# EAGLE design ESP-12E Dev Board_with_level_shifter (EAGLE 9.4.0)

## Sheet 1 of 2
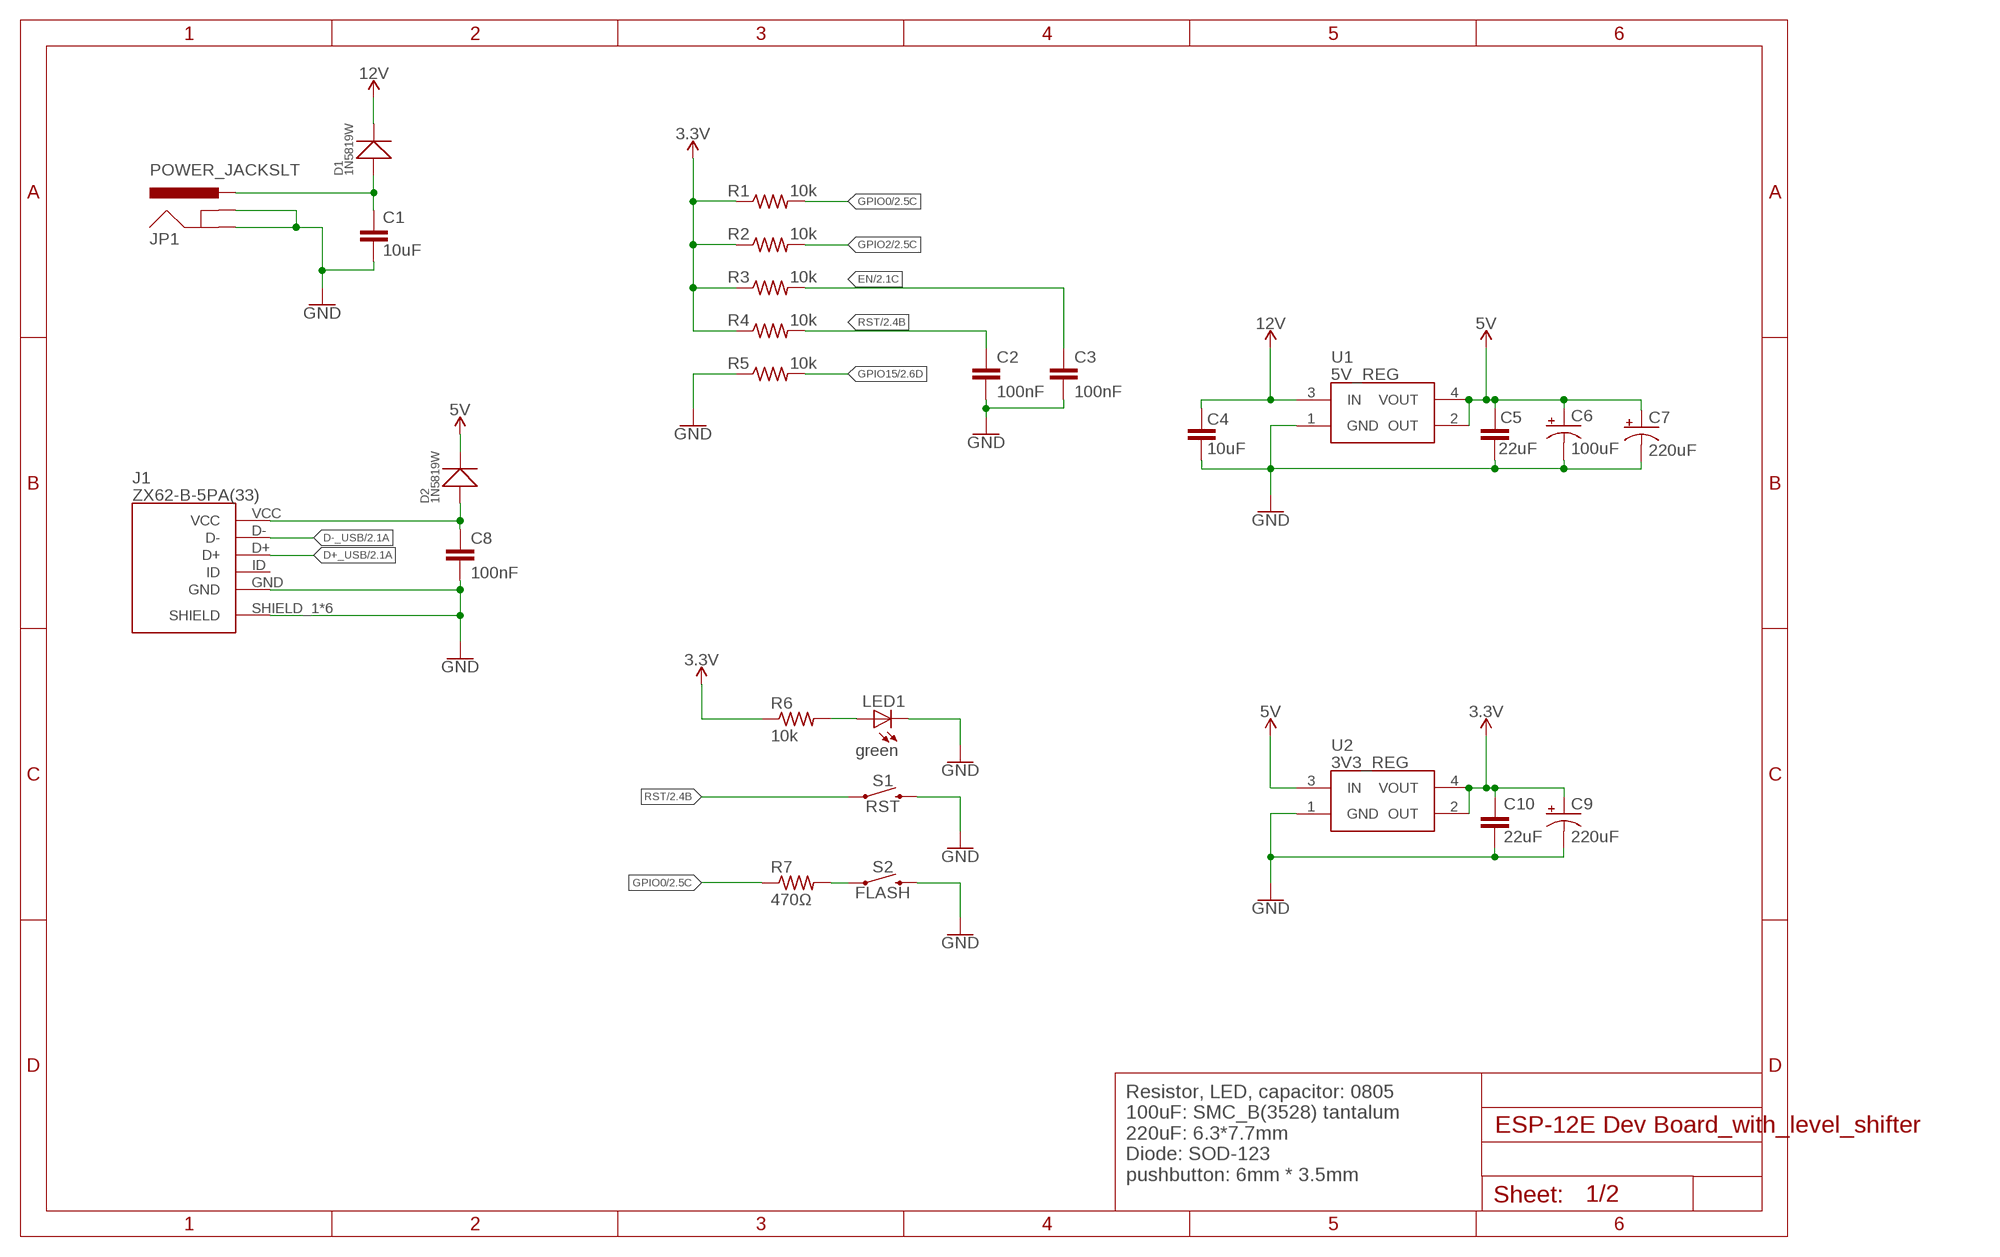
[diagram p0: schematic, sheet 1]

### Parts
C1  10uF  C-EUC0805  [C0805]
C2  100nF  C-EUC0805  [C0805]
C3  100nF  C-EUC0805  [C0805]
C4  10uF  C-EUC0805  [C0805]
C5  22uF  C-EUC0805  [C0805]
C6  100uF  CPOL-USSMCB  [SMC_B]
C7  220uF  CPOL-USUD-6,3X7,7  [UD-6,3X7,7_NICHICON]
C8  100nF  C-EUC0805  [C0805]
C9  220uF  CPOL-USUD-6,3X7,7  [UD-6,3X7,7_NICHICON]
C10  22uF  C-EUC0805  [C0805]
D1  1N5819W  SMD-DIODE-SCHOTTKY-20V-500MA(SOD-123)  [SOD-123]
D2  1N5819W  SMD-DIODE-SCHOTTKY-20V-500MA(SOD-123)  [SOD-123]
J1  ZX62-B-5PA(33)  [ZX62B5PA33]
JP1  POWER_JACKSLT  [POWER_JACK_SLOT]
LED1  green  LEDCHIP-LED0805  [CHIP-LED0805]
R1  10k  R-US_R0805  [R0805]
R2  10k  R-US_R0805  [R0805]
R3  10k  R-US_R0805  [R0805]
R4  10k  R-US_R0805  [R0805]
R5  10k  R-US_R0805  [R0805]
R6  10k  R-US_R0805  [R0805]
R7  470Ω  R-US_R0805  [R0805]
S1  RST  MOMENTARY-SWITCH-SPST-SMD-6.0X3.5MM  [TACTILE_SWITCH_SMD_6.0X3.5MM]
S2  FLASH  MOMENTARY-SWITCH-SPST-SMD-6.0X3.5MM  [TACTILE_SWITCH_SMD_6.0X3.5MM]
U1  5V_REG  AZ1117H-5.0TRE1  [SOT230P700X170-4N]
U2  3V3_REG  AZ1117H-5.0TRE1  [SOT230P700X170-4N]

### Nets
3.3V [power]: C9.+ C10.2 R1.1 R2.1 R3.1 R4.1 R6.1 U2.2(OUT) U2.4(VOUT) ; also sheet 2
5V [power]: C5.1 C6.+ C7.+ D2.- U1.2(OUT) U1.4(VOUT) U2.3(IN) ; also sheet 2
12V [power]: C4.1 D1.- U1.3(IN) ; also sheet 2
D+_USB: J1.D+ ; also sheet 2
D-_USB: J1.D- ; also sheet 2
EN: C3.2 R3.2 ; also sheet 2
GND [power]: C1.1 C2.1 C3.1 C4.2 C5.2 C6.- C7.- C8.1 C9.- C10.1 J1.GND J1.SHIELD_1(SHIELD) J1.SHIELD_2(SHIELD) J1.SHIELD_3(SHIELD) J1.SHIELD_4(SHIELD) J1.SHIELD_5(SHIELD) J1.SHIELD_6(SHIELD) JP1.GND@1(GNDBREAK) JP1.GND@2(GND) LED1.C R5.1 S1.2 S2.2 U1.1(GND) U2.1(GND) ; also sheet 2
GPIO0: R1.2 R7.1 ; also sheet 2
GPIO2: R2.2 ; also sheet 2
GPIO15: R5.2 ; also sheet 2
N$3: C1.2 D1.+ JP1.PWR
N$4: LED1.A R6.2
N$10 [power]: C8.2 D2.+ J1.VCC
POWER1: R7.2 S2.1
RST: C2.2 R4.2 S1.1 ; also sheet 2
Unconnected: J1.ID

### Notes on the sheet
- Resistor, LED, capacitor: 0805
  100uF: SMC_B(3528) tantalum
  220uF: 6.3*7.7mm
  Diode: SOD-123
  pushbutton: 6mm * 3.5mm

## Sheet 2 of 2
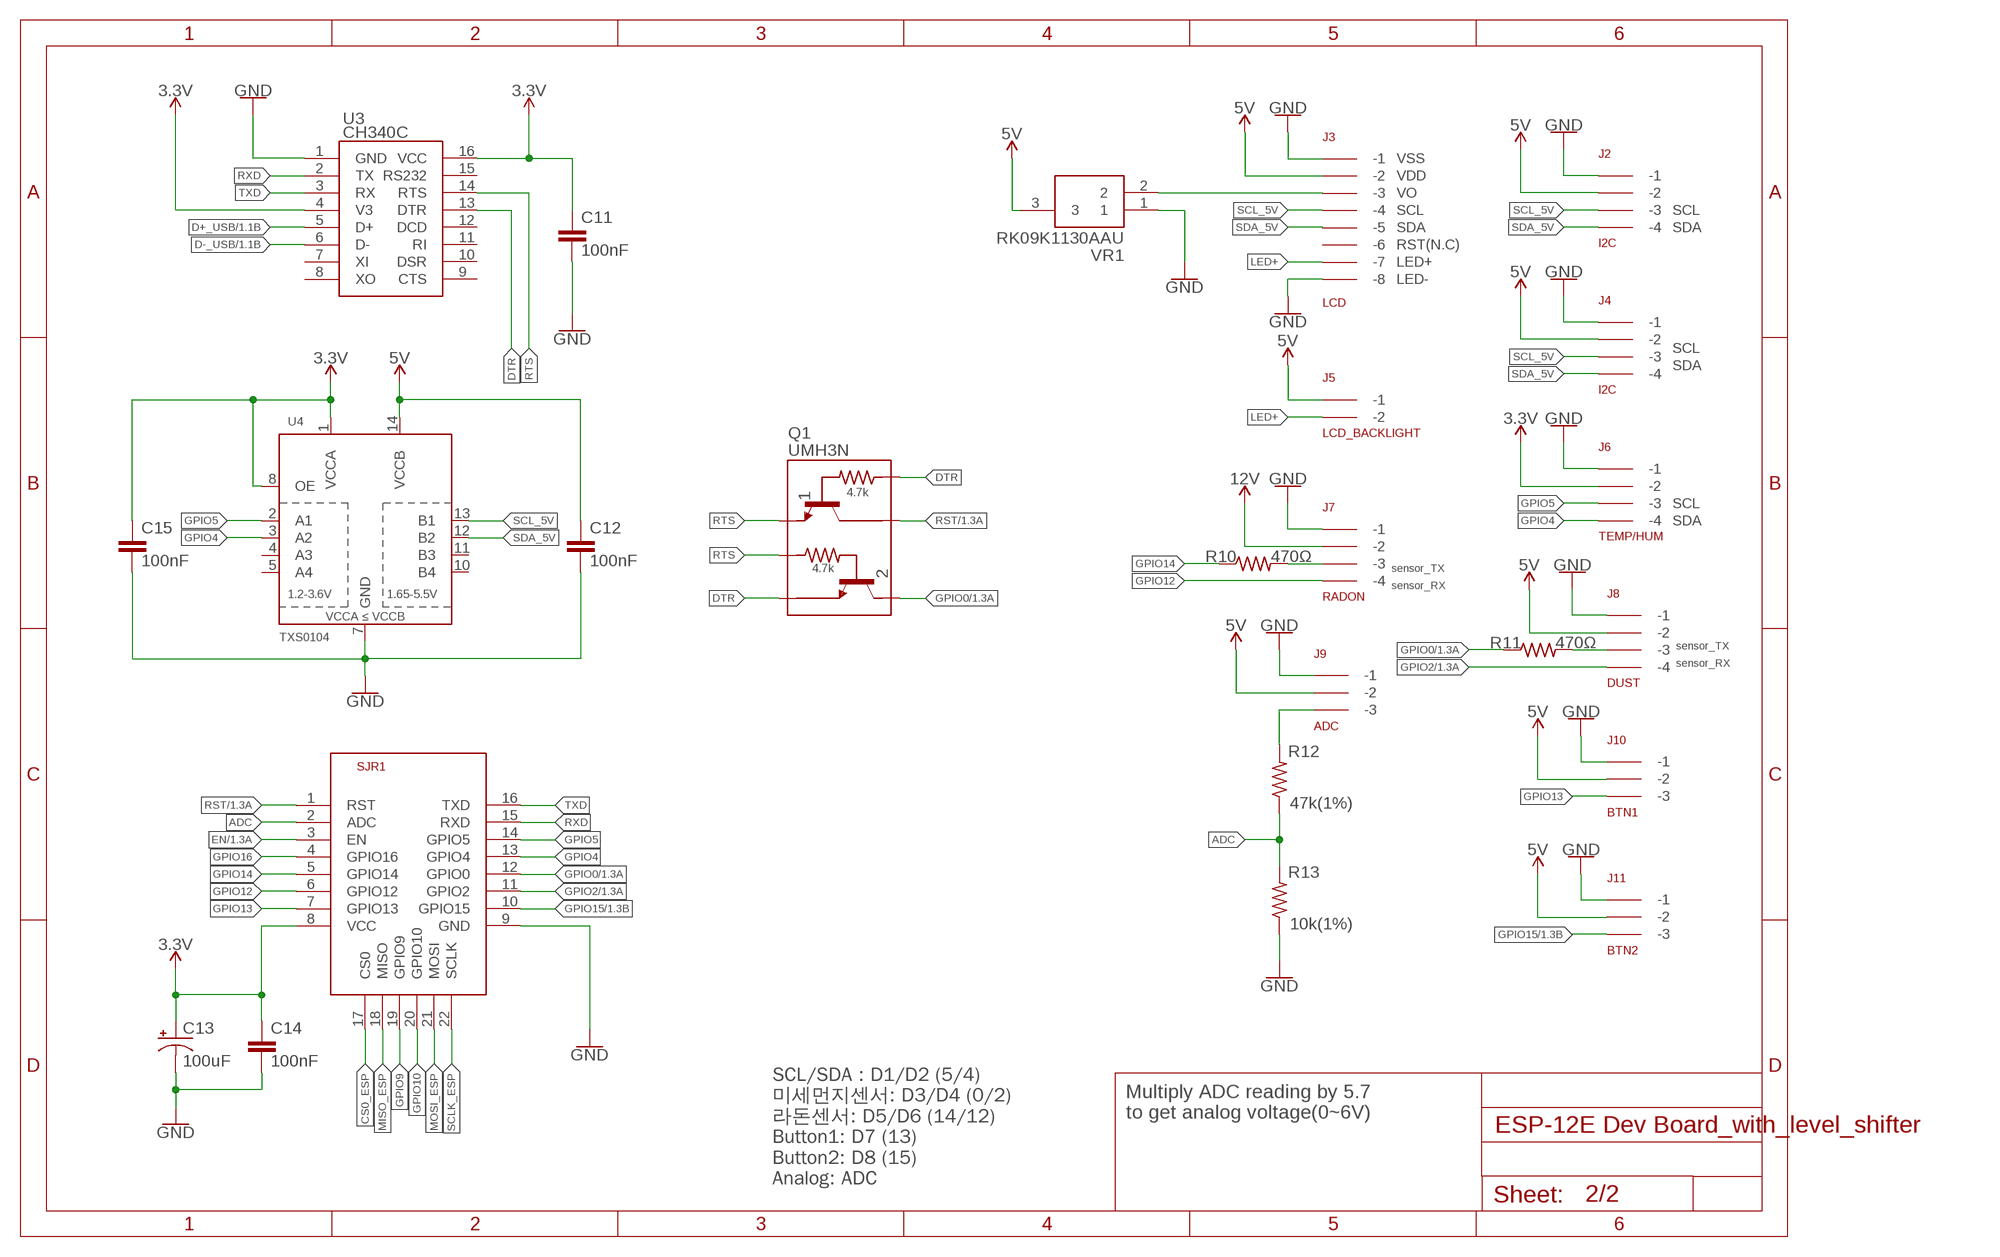
[diagram p1: schematic, sheet 2]

### Parts
C11  100nF  C-EUC0805  [C0805]
C12  100nF  C-EUC0805  [C0805]
C13  100uF  CPOL-USSMCB  [SMC_B]
C14  100nF  C-EUC0805  [C0805]
C15  100nF  C-EUC0805  [C0805]
J2  I2C  5267-4  [5267-4]
J3  LCD  5267-8  [5267-8]
J4  I2C  5267-4  [5267-4]
J5  LCD_BACKLIGHT  5267-2  [5267-2]
J6  TEMP/HUM  5267-4  [5267-4]
J7  RADON  5267-4  [5267-4]
J8  DUST  5267-4  [5267-4]
J9  ADC  5267-3  [5267-3]
J10  BTN1  5267-3  [5267-3]
J11  BTN2  5267-3  [5267-3]
Q1  UMH3N  UMH3NFHATN  [SOT65P210X100-6N]
R10  470Ω  R-US_R0805  [R0805]
R11  470Ω  R-US_R0805  [R0805]
R12  47k(1%)  R-US_R0805  [R0805]
R13  10k(1%)  R-US_R0805  [R0805]
SJR1  ESP-12E  ESP8266-12EESP12E  [ESP8266-ESP12E]
U3  CH340C  CH340G  [SOIC16]
U4  TXS0104  TXB0104PWR  [TSSOP14]
VR1  RK09K1130AAU  RK09K1130A6S  [RK09K1130BGM]

### Nets
3.3V [power]: C11.2 C13.+ C14.2 C15.2 J6.P$2(-2) SJR1.8(VCC) U3.4(V3) U3.16(VCC) U4.1(VCCA) U4.8(OE) ; also sheet 1
5V [power]: C12.2 J2.P$2(-2) J3.P$2(-2) J4.P$2(-2) J5.P$1(-1) J8.P$2(-2) J9.P$2(-2) J10.P$2(-2) J11.P$2(-2) U4.14(VCCB) VR1.3 ; also sheet 1
12V [power]: J7.P$2(-2) ; also sheet 1
ADC: R12.1 R13.2 SJR1.2(ADC)
CS0_ESP: SJR1.17(CS0)
D+_USB: U3.5(D+) ; also sheet 1
D-_USB: U3.6(D-) ; also sheet 1
DTR: Q1.2 Q1.4 U3.13(DTR)
EN: SJR1.3(EN) ; also sheet 1
GND [power]: C11.1 C12.1 C13.- C14.1 C15.1 J2.P$1(-1) J3.P$1(-1) J3.P$8(-8) J4.P$1(-1) J6.P$1(-1) J7.P$1(-1) J8.P$1(-1) J9.P$1(-1) J10.P$1(-1) J11.P$1(-1) R13.1 SJR1.9(GND) U3.1(GND) U4.7(GND) VR1.1 ; also sheet 1
GPIO0: Q1.3 R11.1 SJR1.12(GPIO0) ; also sheet 1
GPIO2: J8.P$4(-4) SJR1.11(GPIO2) ; also sheet 1
GPIO4: J6.P$4(-4) SJR1.13(GPIO4) U4.3(A2)
GPIO5: J6.P$3(-3) SJR1.14(GPIO5) U4.2(A1)
GPIO9: SJR1.19(GPIO9)
GPIO10: SJR1.20(GPIO10)
GPIO12: J7.P$4(-4) SJR1.6(GPIO12)
GPIO13: J10.P$3(-3) SJR1.7(GPIO13)
GPIO14: R10.1 SJR1.5(GPIO14)
GPIO15: J11.P$3(-3) SJR1.10(GPIO15) ; also sheet 1
GPIO16: SJR1.4(GPIO16)
LED+: J3.P$7(-7) J5.P$2(-2)
MISO_ESP: SJR1.18(MISO)
MOSI_ESP: SJR1.21(MOSI)
N$2: J3.P$3(-3) VR1.2
N$5: J9.P$3(-3) R12.2
N$6: J7.P$3(-3) R10.2
N$9: J8.P$3(-3) R11.2
RST: Q1.6 SJR1.1(RST) ; also sheet 1
RTS: Q1.1 Q1.5 U3.14(RTS)
RXD: SJR1.15(RXD) U3.2(TX)
SCL_5V: J2.P$3(-3) J3.P$4(-4) J4.P$3(-3) U4.13(B1)
SCLK_ESP: SJR1.22(SCLK)
SDA_5V: J2.P$4(-4) J3.P$5(-5) J4.P$4(-4) U4.12(B2)
TXD: SJR1.16(TXD) U3.3(RX)
Unconnected: J3.P$6(-6) U3.7(XI) U3.8(XO) U3.9(CTS) U3.10(DSR) U3.11(RI) U3.12(DCD) U3.15(RS232) U4.4(A3) U4.5(A4) U4.10(B4) U4.11(B3)

### Notes on the sheet
- VSS
- VDD
- VO
- SCL | SCL
- SDA | SDA
- RST(N.C)
- LED+
- LED-
- SCL
- SDA
- SCL
- SDA
- sensor_TX
- sensor_RX
- sensor_TX
- sensor_RX
- SCL/SDA : D1/D2 (5/4)
  미세먼지센서: D3/D4 (0/2)
  라돈센서: D5/D6 (14/12)
  Button1: D7 (13)
  Button2: D8 (15)
  Analog: ADC
- Multiply ADC reading by 5.7
  to get analog voltage(0~6V)

## Library data of the parts
C1-C5 C8 C10-C12 C14 C15 = rcl:C-EU: CAPACITOR, European symbol; SPICEPREFIX: C
C6 C7 C9 C13 = rcl:CPOL-US: POLARIZED CAPACITOR, American symbol; SPICEPREFIX: C
D1 D2 = Seeed-Diode:SMD-DIODE-SCHOTTKY-20V-500MA(SOD-123): 304020032; MPN: SS0520-7-F; VALUE: 20V-500MA
J1 = SamacSys_Parts:ZX62-B-5PA(33): USB Connectors MICRO B RECEPT RA SMT BTTM MNT Source: Datasheet <https://componentsearchengine.com/Datasheets/1/ZX62-B-5PA(33).pdf>; DESCRIPTION: USB Connectors MICRO B RECEPT RA SMT BTTM MNT; HEIGHT: 2.8mm; MANUFACTURER_NAME: Hirose; MANUFACTURER_PART_NUMBER: ZX62-B-5PA(33); MOUSER_PART_NUMBER: 798-ZX62-B-5PA33; MOUSER_PRICE-STOCK: https://www.mouser.com/Search/Refine.aspx?Keyword=798-ZX62-B-5PA33
J2 J4 J6-J8 = con-molex-spox:5267-4
J3 = con-molex-spox:5267-8
J5 = con-molex-spox:5267-2
J9-J11 = con-molex-spox:5267-3
JP1 = kanflo:POWER_JACK: Power Jack This is the standard 5.5mm barrel jack for power. The SLT footprint has been proven in designs produced by DirtyPCBs.com and only works if the mill layer is transmitted to the PCB fab house and the fab house accepts it. Rumours has it OSH Park accepts this design too. This symbol is meant for the cheap PCB mount connectors you find on eBay, retailing at less than 2EUR/10pcs (search for "dc power jack 5.5 2.1 pcb"). The difference between these and the ones sold by eg. SparkFun is the location of the pads relative to the plastic body.
LED1 = adafruit:LED: LED OSRAM: - CHIPLED LG R971, LG N971, LY N971, LG Q971, LY Q971, LO R971, LY R971 LH N974, LH R974 LS Q976, LO Q976, LY Q976 LO Q996 - Hyper CHIPLED LW Q18S LB Q993, LB Q99A, LB R99A - SideLED LS A670, LO A670, LY A670, LG A670, LP A670 LB A673, LV A673, LT A673, LW A673 LH A674 LY A675 LS A676, LA A676, LO A676, LY A676, LW A676 LS A679, LY A679, LG A679 - Hyper Micro SIDELED® LS Y876, LA Y876, LO Y876, LY Y876 LT Y87S - SmartLED LW L88C, LW L88S LB L89C, LB L89S, LG L890 LS L89K, LO L89K, LY L89K LS L896, LA L896, LO L896, LY L896 - TOPLED LS T670, LO T670, LY T670, LG T670, LP T670 LSG T670, LSP T670, LSY T670, LOP T670, LYG T670 LG T671, LOG T671, LSG T671 LB T673, LV T673, LT T673, LW T673 LH T674 LS T676, LA T676, LO T676, LY T676, LB T676, LH T676, LSB T676, LW T676 LB T67C, LV T67C, LT T67C, LS T67K, LO T67K, LY T67K, LW E67C LS E67B, LA E67B, LO E67B, LY E67B, LB E67C, LV E67C, LT E67C LW T67C LS T679, LY T679, LG T679 LS T770, LO T770, LY T770, LG T770, LP T770 LB T773, LV T773, LT T773, LW T773 LH T774 LS E675, LA E675, LY E675, LS T675 LS T776, LA T776, LO T776, LY T776, LB T776 LHGB T686 LT T68C, LB T68C - Hyper Mini TOPLED® LB M676 - Mini TOPLED Santana® LG M470 LS M47K, LO M47K, LY M47K Source: http://www.osram.convergy.de/
Q1 = SamacSys_Parts:UMH3NFHATN: ROHM - UMH3NFHATN - TRANS, NPN, AUTO, 4.7K/4.7K, SOT-353 Source: Datasheet <http://www.rohm.com/web/global/datasheet/UMH3NFHA/umh3nfha-e>; DESCRIPTION: ROHM - UMH3NFHATN - TRANS, NPN, AUTO, 4.7K/4.7K, SOT-353; HEIGHT: 1mm; MANUFACTURER_NAME: ROHM Semiconductor; MANUFACTURER_PART_NUMBER: UMH3NFHATN; MOUSER_PART_NUMBER: 755-UMH3NFHATN; MOUSER_PRICE-STOCK: https://www.mouser.com/Search/Refine.aspx?Keyword=755-UMH3NFHATN
R1-R7 R10-R13 = rcl:R-US_: RESISTOR, American symbol; SPICEPREFIX: R
S1 S2 = SparkFun-Switches:MOMENTARY-SWITCH-SPST: Momentary Switch (Pushbutton) - SPST Normally-open (NO) SPST momentary switches (buttons, pushbuttons). Variants PTH-12MM - 12mm square, through-hole Momentary Pushbutton Switch - 12mm Square <https://www.sparkfun.com/products/9190> (COM-09190) PTH-6.0MM, PTH-6.0MM-KIT - 6.0mm square, through-hole Mini Pushbutton Switch <https://www.sparkfun.com/products/97> (COM-00097) KIT package intended for soldering kit's - only one side of pads' copper is exposed. PTH-RIGHT-ANGLE-KIT - Right-angle, through-hole Right Angle Tactile Button <https://www.sparkfun.com/products/10791> - Used on SparkFun BigTime Watch Kit <https://www.sparkfun.com/products/11734> SMD-12MM - 12mm square, surface-mount Tactile Button - SMD (12mm) <https://www.sparkfun.com/products/12993> (COM-12993) Used on SparkFun PicoBoard <https://www.sparkfun.com/products/11888> SMD-4.5MM - 4.5mm Square Trackball Switch Used on SparkFun Blackberry Trackballer Breakout <https://www.sparkfun.com/products/13169> SMD-4.6MMX2.8MM - 4.60mm x 2.80mm, surface mount Used on SparkFun SAMD21 Mini Breakout <https://www.sparkfun.com/products/13664> SMD-5.2MM, SMD-5.2-REDUNDANT - 5.2mm square, surface-mount Mini Pushbutton Switch - SMD <https://www.sparkfun.com/products/8720> (COM-08720) Used on Arduino Pro Mini <https://www.sparkfun.com/products/11114> REDUNDANT package connects both switch circuits together SMD-6.0X3.5MM - 6.0 x 3.5mm, surface mount Momentary Reset Switch SMD <https://www.sparkfun.com/products/8229> (COM-08229) SMD-6.2MM-TALL - 6.2mm square, surface mount Tactile Button - SMD (6mm) <https://www.sparkfun.com/products/12992> Used on SparkFun Digital Sandbox <https://www.sparkfun.com/products/12651> SMD-RIGHT-ANGLE - Right-angle, surface mount Used on SparkFun Block for Intel® Edison - Arduino <https://www.sparkfun.com/products/13036>; PROD_ID: SWCH-00815; SF_SKU: COM-08229
SJR1 = esp12e:ESP8266-12E: ESP8266-12E Library for Eagle CAD The author not responsible for any damages or errors!. Created by Suhail jr.lt;/author>
U1 U2 = SamacSys_Parts:AZ1117H-5.0TRE1: 1A 5V LDO Linear Voltage Reg SOT-223 Diodes Inc AZ1117H-5.0TRE1, Single Linear Voltage Regulator, 1A 4.9 5.1 V, 1%, 3-Pin SOT-223 Source: Datasheet <https://componentsearchengine.com/Datasheets/1/AZ1117H-5.0TRE1.pdf>; DESCRIPTION: 1A 5V LDO Linear Voltage Reg SOT-223 Diodes Inc AZ1117H-5.0TRE1, Single Linear Voltage Regulator, 1A 4.9 5.1 V, 1%, 3-Pin SOT-223; HEIGHT: 1.7mm; MANUFACTURER_NAME: Diodes Inc.; MANUFACTURER_PART_NUMBER: AZ1117H-5.0TRE1; MOUSER_PART_NUMBER: 621-AZ1117H-5.0TRE1; MOUSER_PRICE-STOCK: https://www.mouser.com/Search/Refine.aspx?Keyword=621-AZ1117H-5.0TRE1
U3 = ch340g:CH340G
U4 = SparkFun-IC-Comms:TXB0104PWR: 4-Bit Bi-Directional Level Shifter 1.2V-3.6V (VCCA) to 1.65V-5.5V (VCCB) bi-directional level shifter with auto direction sensing. Max data rate - VCCA 1.8V: 20Mbps (50ns), VCCA 3.3V: 100Mbps (10ns) Digikey: 296-21929-1-ND (TSSOP) Datasheet <http://cdn.sparkfun.com/datasheets/BreakoutBoards/txb0104.pdf> SparkFun Products SparkFun Cellular Shield - MG2639 <https://www.sparkfun.com/products/13120> (CEL-13120) SparkFun Level Shifting microSD Breakout <https://www.sparkfun.com/products/13743> (DEV-13743) SparkFun Voltage-Level Translator Breakout - TXB0104 <https://www.sparkfun.com/products/11771> (BOB-11771) SparkFun Block for Intel® Edison - UART <https://www.sparkfun.com/products/13040> (DEV-13040) SparkFun Block for Intel® Edison - Arduino <https://www.sparkfun.com/products/13036> (DEV-13036); PROD_ID: NA-XXXXX; VALUE: TXB0104
VR1 = SamacSys_Parts:RK09K1130A6S: Audio single pot. 10K Vertical 15mm,1B Alps RK09K Series, Linear Potentiometer with a 6 mm Dia. Shaft, 10k, +/-20%, Through Hole Source: Datasheet <https://componentsearchengine.com/Datasheets/1/RK09K1130A6S.pdf>; DESCRIPTION: Audio single pot. 10K Vertical 15mm,1B Alps RK09K Series, Linear Potentiometer with a 6 mm Dia. Shaft, 10k, +/-20%, Through Hole; HEIGHT: mm; MANUFACTURER_NAME: ALPS; MANUFACTURER_PART_NUMBER: RK09K1130A6S; MOUSER_PART_NUMBER: 688-RK09K1130A6S; MOUSER_PRICE-STOCK: https://www.mouser.com/Search/Refine.aspx?Keyword=688-RK09K1130A6S

## Net classes
1 power: width 0.457 mm

## Board
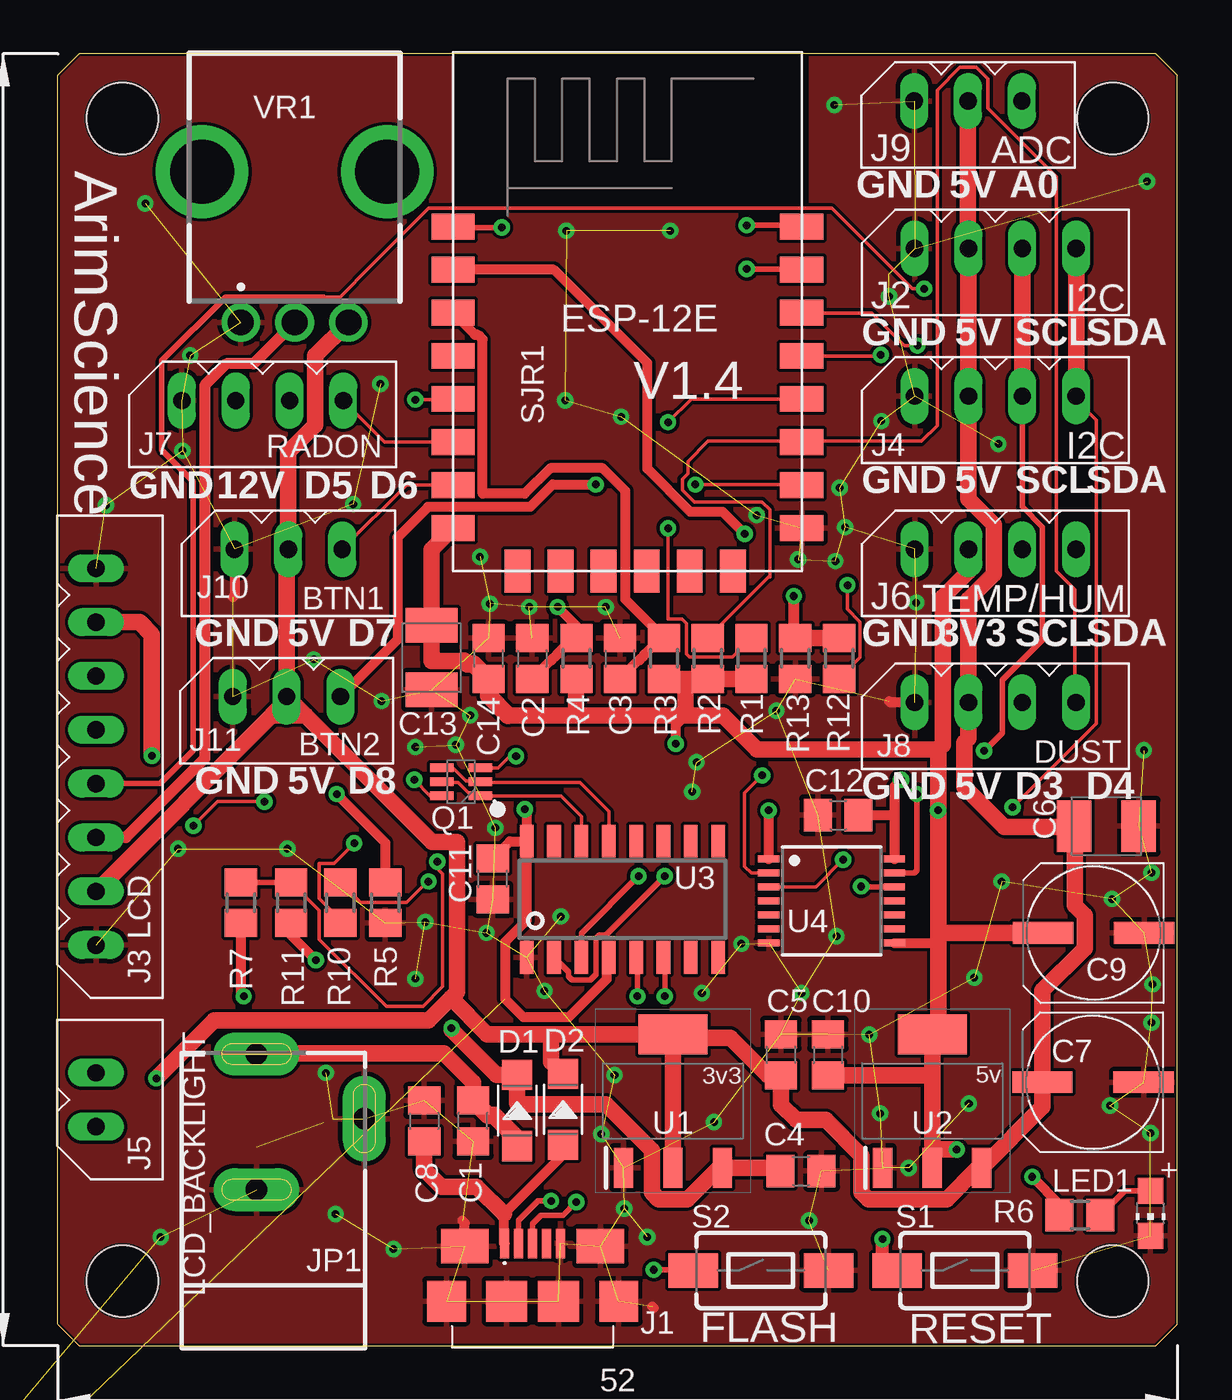
[diagram p2: board, top side]
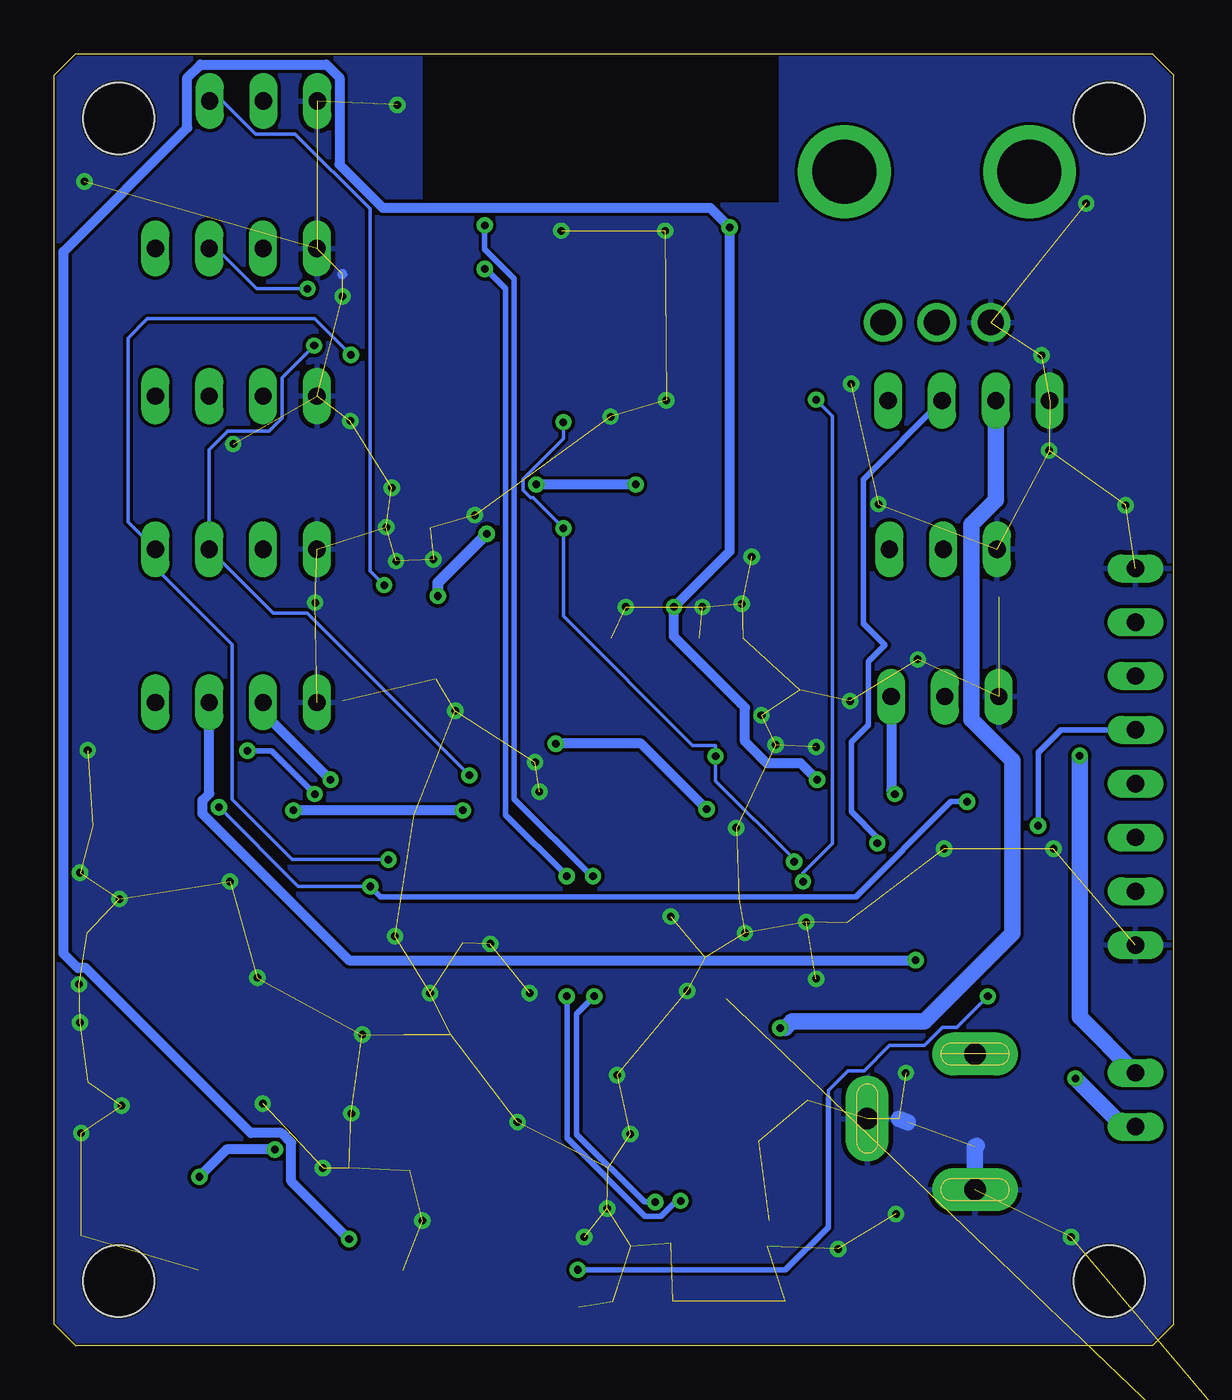
[diagram p3: board, bottom side, seen from below]

Size 52 x 60 mm. Coordinates in mm from the lower left corner, seen from the top.
Outline: 0,1 0,59 1,60 51,60 52,59 52,1 51,0 1,0 0,1
Copper layers (1*16): Top 0.035mm / dielectric 1.5mm / Bottom 0.035mm
Design rules "default *": minimum track width 6mil, minimum drill 0.35mm, track to track 6mil, track to pad 6mil, pad to pad 6mil, via to via 6mil, smd to smd 6mil, copper to edge 4mil, drill to drill 6mil, minimum pad ring 10mil, minimum via ring 8mil, stop-mask expansion 4mil, vias tented up to drill 15mil, thermal gap 8mil
Holes 3.3 mm at 3,57 49,57 49,3 3,3

### Footprints (pad centres in the part's own frame; a part is rotated, then mirrored left to right if it is on the bottom)
C0805 = smd 1.3 x 1.5: 1 -0.95,0; 2 0.95,0
SMC_B = smd 1.6 x 2.4: + -1.5,0; - 1.5,0
UD-6,3X7,7_NICHICON = smd 2.8 x 1: + 2.35,0; - -2.35,0
SOD-123 = smd 1.397 x 1.397: + -1.651,0; - 1.651,0
ZX62B5PA33 = smd 0.4 x 1.35: D+ 0,1.95; D- -0.65,1.95; GND 1.3,1.95; ID 0.65,1.95; VCC -1.3,1.95 | smd 2.2 x 1.6: SHIELD_1 -3.15,1.825; SHIELD_6 3.15,1.825 | smd 1.8 x 1.9: SHIELD_2 -4,-0.725; SHIELD_5 4,-0.725 | smd 1.9 x 1.9: SHIELD_3 -1.2,-0.725; SHIELD_4 1.2,-0.725
5267-4 = drill 0.8 long: P$1 0,0; P$2 2.5,0; P$3 5,0; P$4 7.5,0
5267-8 = drill 0.8 long: P$1 0,0; P$2 2.5,0; P$3 5,0; P$4 7.5,0; P$5 10,0; P$6 12.5,0; P$7 15,0; P$8 17.5,0
5267-2 = drill 0.8 long: P$1 0,0; P$2 2.5,0
5267-3 = drill 0.8 long: P$1 0,0; P$2 2.5,0; P$3 5,0
POWER_JACK_SLOT = drill 1 pad 2 long: GND@1 2.5,1.39; GND@2 -2.5,-1.91; PWR 2.5,-4.91
CHIP-LED0805 = smd 1.2 x 1.2: A 0,-1.05; C 0,1.05
SOT65P210X100-6N = smd 1.1 x 0.4: 1 -0.9,0.65; 2 -0.9,0; 3 -0.9,-0.65; 4 0.9,-0.65; 5 0.9,0; 6 0.9,0.65
R0805 = smd 1.3 x 1.5: 1 -0.95,0; 2 0.95,0
TACTILE_SWITCH_SMD_6.0X3.5MM = smd 2.3 x 1.6: 1 -3.15,0; 2 3.15,0
ESP8266-ESP12E = smd 2 x 1.2: 1 -7.62,5.84; 2 -7.62,3.84; 3 -7.62,1.84; 4 -7.62,-0.16; 5 -7.62,-2.16; 6 -7.62,-4.16; 7 -7.62,-6.16; 8 -7.62,-8.16; 9 8.58,-8.16; 10 8.58,-6.16; 11 8.58,-4.16; 12 8.58,-2.16; 13 8.58,-0.16; 14 8.58,1.84; 15 8.58,3.84; 16 8.58,5.84 | smd 1.2 x 2: 17 -4.62,-10.16; 18 -2.62,-10.16; 19 -0.62,-10.16; 20 1.38,-10.16; 21 3.38,-10.16; 22 5.38,-10.16
SOT230P700X170-4N = smd 1.85 x 0.9: 1 -3.1,2.3; 2 -3.1,0; 3 -3.1,-2.3 | smd 1.85 x 3.2: 4 3.1,0
SOIC16 = smd 0.635 x 1.524: 1 -4.445,-2.695; 2 -3.175,-2.695; 3 -1.905,-2.695; 4 -0.635,-2.695; 5 0.635,-2.695; 6 1.905,-2.695; 7 3.175,-2.695; 8 4.445,-2.695; 9 4.445,2.695; 10 3.175,2.695; 11 1.905,2.695; 12 0.635,2.695; 13 -0.635,2.695; 14 -1.905,2.695; 15 -3.175,2.695; 16 -4.445,2.695
TSSOP14 = smd 0.305 x 0.991: 1 -1.95,-2.918; 2 -1.3,-2.918; 3 -0.65,-2.918; 4 0,-2.918; 5 0.65,-2.918; 6 1.3,-2.918; 7 1.95,-2.918; 8 1.95,2.918; 9 1.3,2.918; 10 0.65,2.918; 11 0,2.918; 12 -0.65,2.918; 13 -1.3,2.918; 14 -1.95,2.918
RK09K1130BGM = drill 1.2 pad 1.8: 1 -2.5,-12.5; 2 0,-12.5; 3 2.5,-12.5 | drill 2.97 pad 4.3: 4 4.3,-5.5; 5 -4.3,-5.5

### Placement (x,y rotation side)
C1  19.29,10.43 90 top
C2  22.03,31.92 270 top
C3  26.11,31.92 270 top
C4  34.52,8.11 0 top
C5  33.59,13.51 90 top
C6  48.71,24.13 0 top
C7  48.08,12.23 180 top
C8  17.02,10.43 270 top
C9  48.11,19.17 180 top
C10  35.77,13.51 270 top
C11  20.2,21.68 90 top
C12  36.24,24.64 0 top
C13  17.36,31.96 270 top
C14  20,31.91 270 top
C15  -5.03,-7.7 0 top  (outside the outline)
D1  21.34,10.92 90 top
D2  23.47,10.97 90 top
J1  22.05,2.79 0 top
J2  39.8,50.96 0 top
J3  1.78,18.6 90 top
J4  39.8,44.1 0 top
J5  1.78,10.17 90 top
J6  39.8,36.99 0 top
J7  5.76,43.9 0 top
J8  39.8,29.88 0 top
J9  39.78,57.81 0 top
J10  8.21,36.99 0 top
J11  8.13,30.15 0 top
JP1  11.73,8.64 180 top
LED1  50.75,6.15 180 top
Q1  18.73,26.19 180 top
R1  32.22,31.92 90 top
R2  30.19,31.92 90 top
R3  28.15,31.92 90 top
R4  24.09,31.92 90 top
R5  15.21,20.57 90 top
R6  47.48,6.06 0 top
R7  8.51,20.57 270 top
R10  13.13,20.57 270 top
R11  10.84,20.57 270 top
R12  36.29,31.92 270 top
R13  34.26,31.92 90 top
S1  42.13,3.49 0 top
S2  32.65,3.49 0 top
SJR1  25.97,46.13 0 top
U1  28.57,11.37 90 top
U2  40.61,11.37 90 top
U3  26.23,20.73 0 top
U4  35.94,20.66 270 top
VR1  11,60.02 0 top

### Tracks (layer width: path | path; a pad name or v marks a point on that pad's centre or on a via)
3.3V  (via drill 0.35)  (1 unrouted)
  Top 0.457: U4.1 v33.02,24.86 | U4.8 40.85,18.7 40.89,18.66 | v28.7,27.96 28.7,28.82 29.16,29.28 | C11.2 21,23.43 U3.16 | v21.69,24.91 21.78,24.82 U3.16 | U3.4 25.5,17.95 25.5,17.03 23.75,15.27 21.61,15.27 20.78,16.1 20.78,18.76 21.78,19.76 U3.16 | v45.26,7.84 46.53,6.58 R6.1
  Top 0.762: R3.1 29.16,30.97 | 29.16,30.97 R2.1 R1.1 | J6.P$2 42.3,35.95 41.11,34.76 41.11,27.91 40.89,27.69 | v41.76,9.11 40.61,9.11 U2.2 40.61,12.62 | 40.89,27.69 v40.89,24.86 40.89,19.17 | SJR1.8 17.36,36.98 C13.+ 17.36,31.8 17.37,31.79 18.86,31.79 | 29.16,29.28 30.89,29.28 32.48,27.69 40.89,27.69 | 29.16,30.97 29.16,29.28 | 40.89,19.17 40.89,18.66 40.89,14.75 U2.4 40.61,12.62 | C9.+ 40.89,19.17 | C10.2 40.56,12.56 40.61,12.62 | 29.16,29.28 24.08,29.28 | 24.08,29.28 20.92,29.28 | 24.08,29.28 R4.1
  Top 0.813: 20.92,29.28 20,30.2 C14.2 19.31,31.65 19.02,31.65 18.88,31.79 18.86,31.79
  Bottom 0.457: v33.02,24.86 v40.89,24.86 | v21.69,24.91 24.74,27.96 v28.7,27.96 | v41.76,9.11 43.99,9.11 v45.26,7.84
5V  (via drill 0.35)
  Top 0.457: 38.86,24.66 38.86,25.98 v39.17,26.28 | 38.86,24.66 38.86,22.65 U4.14 | C12.2 37.21,24.66 38.86,24.66
  Top 0.762: J9.P$2 42.28,50.98 J2.P$2 J4.P$2 42.3,39.32 43.49,38.14 43.49,35.84 42.3,34.66 J8.P$2 42.3,28.19 42.12,28.01 42.12,25.96 43.97,24.1 47.18,24.1 C6.+ 47.24,24.09 47.24,20.44 47.69,19.99 47.69,18.45 45.73,16.49 C7.+ 45.73,11.09 U2.3 42.74,8.27 41.28,6.81 37.64,6.81 37.33,7.12 37.33,8.82 35.67,10.48 34.3,10.48 33.59,11.2 C5.1 32.98,12.56 31.24,14.3 28.74,14.3 U1.4 | J11.P$2 10.63,36.91 J10.P$2 10.71,41.51 11.95,42.75 11.95,45.98 VR1.3 | J3.P$2 9.94,29.26 | 9.94,29.26 10.63,29.95 J11.P$2 | J11.P$2 11.51,29.26 | 11.51,29.26 17.38,23.4 18.54,23.4 18.54,16.42 18.27,16.14 | 11.51,29.26 9.94,29.26 | v4.57,12.41 7.26,15.11 17.23,15.11 18.27,16.14 | 18.27,16.14 19.94,14.47 22.91,14.47 | U1.4 22.91,14.47 | U1.2 U1.4 | D2.- 22.91,13.18 22.91,14.47
  Bottom 0.457: v39.17,26.28 42.29,29.41 42.29,29.81 J8.P$2
  Bottom 0.762: v4.57,12.41 2.33,10.17 J5.P$1
12V  (via drill 0.35)
  Top 0.762: v18.29,14.75 18.29,14.66 20.37,12.57 D1.- 21.34,11.25 21.38,11.2 25.47,11.2 27.59,9.08 27.59,7.12 27.9,6.81 29.25,6.81 30.7,8.27 U1.3 33.42,8.27 C4.1
  Bottom 0.762: v18.29,14.75 18.03,14.75 17.73,15.06 11.58,15.06 7.5,19.14 7.5,27.19 9.39,29.08 9.39,38.14 8.26,39.27 J7.P$2
ADC  (via drill 0.35)
  Top 0.457: v31.9,37.71 30.89,38.73 29.38,38.73 27.38,40.73 27.38,45.64 23.04,49.97 SJR1.2
  Top 0.508: R13.2 34.19,32.94 v34.19,34.82
  Top 0.762: R12.1 R13.2
  Bottom 0.508: v31.9,37.71 34.19,35.43 v34.19,34.82
D+_USB  (via drill 0.35)
  Top 0.254: v26.92,16.22 26.92,17.98 U3.5 | v24.08,6.67 23.47,6.06 22.45,6.06 22.05,5.67 J1.D+
  Bottom 0.254: v24.08,6.67 24.59,6.67 27.74,9.82 27.74,15.41 v26.92,16.22
D-_USB  (via drill 0.35)
  Top 0.254: v28.19,16.22 28.19,17.98 U3.6 | v22.91,6.72 22.3,6.72 21.4,5.83 J1.D-
  Bottom 0.254: v28.19,16.22 28.19,9.66 24.55,6.02 23.81,6.02 23.1,6.72 v22.91,6.72
DTR
  Top 0.152: Q1.4 17.91,26.84 18.36,26.84 18.97,26.23 19.58,26.23 Q1.2 19.66,26.16 24.26,26.16 25.59,24.82 U3.13
EN
  Top 0.457: SJR1.3 19.37,46.95 19.51,46.95 19.73,46.73 19.73,39.56 21.68,39.56 22.88,40.76 25.31,40.76 26.36,39.7 26.36,34.66 R3.2 28.01,32.87 27.24,32.1 27.24,32.06 27.02,31.84 26.98,31.84 C3.2
GND  (via drill 0.35)  (115 unrouted)
  Top 0.457: J8.P$1 38.67,29.88 38.61,29.94 | J1.SHIELD_2 17.98,2 | 27.62,1.81 27.69,1.75 | J1.SHIELD_1 18.9,5.7 18.8,5.81 | J10.P$1 8.21,34.85 8.13,34.77
  Bottom 0.457: 38.61,49.77 38.61,49.75
  Bottom 0.762: JP1.GND@1 9.23,9.23 9.14,9.28 | 12.77,10.55 12.36,10.38
  other vias: 15.6,4.49 23.62,51.78 28.45,51.78 23.57,43.91 26.16,43.15 29.46,25.72 29.92,16.38 5.59,23.08 10.67,23.08 4.78,5.05 14.99,44.67 13.72,39.08 42.57,17.09 50.85,16.78 43.84,21.56 50.75,9.87 25.86,12.57 30.48,10.38 26.31,6.37 36.58,38.02 39.88,34.51 5.79,41.57 33.38,29.48 19.15,29.28 18.49,27.91 29.67,27.1 12.9,6.11 16.61,17.04 2.24,39.03 4.06,53.05 36.07,57.63 43.69,41.88 50.8,15 50.8,21.96 42.32,11.25 39.52,8.25 32.46,38.58 12.45,12.67 38.61,48.74 38.25,42.94 6.15,45.99 22.61,16.48 25.25,9.82 34.9,5.81 36.12,36.44 19.61,36.65 20.07,34.46 23.37,19.93 48.97,20.75 48.87,11.14 38.2,10.79 34.54,16.38 21.89,34.31 16.61,27.81 34.39,36.52 36.32,39.85 50.6,54.07 11.89,31.87 17.07,19.68 27.38,5.05 50.44,27.65 25.45,34.31 15.04,29.94 37.69,14.45 36.17,19.02 31.75,18.66 20.32,24.05 19.91,19.17
  pour Top: -6.89,65.66 -6.89,-4.32 54.72,-4.32 54.72,65.66
  pour Bottom: -6.86,65.66 -6.86,-4.35 55.72,-4.35 55.72,65.66
GPIO0  (via drill 0.35)
  Top 0.152: v21.29,27.38 20.98,27.38 20.45,26.84 Q1.3 | v17.63,22.47 17.63,22.17 17.88,21.91 17.88,16.68 16.97,15.77 15.26,15.77 12.15,18.88 12.15,20.22 R11.1 | v28.35,42.89 29.43,43.97 SJR1.12 | R1.2 31.34,31.99 29.34,31.99 29.21,32.13 29.21,33.54 29,33.75 28.35,33.75 v28.35,37.97
  Top 0.254: R7.1 R11.1
  Bottom 0.152: v17.63,22.47 17.63,22.57 21.29,26.23 v21.29,27.38 21.29,27.88 22.35,27.88 28.35,33.88 v28.35,37.97 29.77,39.39 29.87,39.39 30.22,39.75 30.22,40.25 28.35,42.13 v28.35,42.89
GPIO2
  Top 0.152: SJR1.11 34.59,42.01 | J8.P$4 47.24,29.89 47.24,35.12 46.38,35.98 46.38,54.3 43.2,57.47 43.2,58.84 42.67,59.38 41.91,59.38 40.84,58.31 40.84,42.74 40.11,42.01 34.59,42.01 | 34.59,42.01 30.2,42.01 29.26,41.06 29.26,40.5 29.01,40.25 29.01,39.75 29.57,39.18 32.71,39.18 33.07,38.83 33.07,35.7 33.02,35.7 R2.2
GPIO4  (via drill 0.35)
  Top 0.152: v38.23,46.02 38.18,45.97 34.59,45.97 SJR1.13 | U4.3 35.2,21.3 v36.47,22.57
  Bottom 0.152: v38.23,46.02 39.9,47.7 47.68,47.7 48.56,46.81 48.56,38.26 J6.P$4 47.24,36.98 47.24,36.06 43.74,32.56 43.74,25.37 40.95,22.57 v36.47,22.57
GPIO5  (via drill 0.35)
  Top 0.152: v39.93,46.45 39.32,46.45 37.82,47.95 34.59,47.95 SJR1.14 | v32.72,26.49 31.9,25.67 31.9,22.27 32.22,21.95 U4.2
  Bottom 0.152: v39.93,46.45 41.42,44.96 41.42,43.08 42.02,42.48 43.94,42.48 44.8,41.62 J6.P$3 41.84,34.03 40.26,34.03 v32.72,26.49
GPIO12
  Top 0.152: J7.P$4 15.19,41.97 SJR1.6
GPIO13
  Top 0.152: J10.P$3 16.19,39.97 SJR1.7
GPIO14  (via drill 0.35)
  Top 0.152: v17.22,21.56 17.17,21.56 16.2,20.59 14.06,20.59 R10.1 | v16.61,43.94 18.31,43.94 SJR1.5
  Bottom 0.152: v17.22,21.56 17.22,21.96 15.85,23.34 15.85,43.17 v16.61,43.94
GPIO15  (via drill 0.35)
  Top 0.152: v29.62,40 34.53,40 SJR1.10
  Top 0.457: v24.99,40 22.98,40 21.94,38.95 17.19,38.95 15.78,37.54 15.78,32.8 J11.P$3 | v12.95,25.62 15.21,23.37 R5.2
  Bottom 0.457: v24.99,40 v29.62,40 | J11.P$3 13.13,25.8 v12.95,25.62
LED+  (via drill 0.35)
  Top 0.762: v4.37,27.4 4.37,33.04 3.81,33.6 J3.P$7
  Bottom 0.762: J5.P$2 4.37,15.27 v4.37,27.4
N$2
  Top 0.508: VR1.2 9.09,45.61 7.83,45.61 6.82,44.61 6.82,27.26 3.16,23.6 J3.P$3
N$3
  Top 0.762: C1.2 19.29,12.23 17.93,13.58 9.27,13.58 JP1.PWR
  Top 0.813: C1.2 19.98,10.69 20.27,10.69 21.34,9.62 D1.+
N$4
  Top 0.254: R6.2 49.56,7.2 LED1.A
N$5  (via drill 0.35)
  Top 0.152: v36.68,35.33 36.68,34.21 37.27,33.62 37.27,31.95 R12.2
  Bottom 0.152: v36.68,35.33 37.34,35.98 37.34,52.8 40.81,56.27 42.65,56.27 44.18,57.81 J9.P$3
N$6  (via drill 0.35)
  Top 0.152: R10.2 13.13,19.8 12.15,20.78 12.15,22.4 12.83,22.4 v13.77,23.34
  Bottom 0.254: J7.P$3 14.43,40.23 14.43,33.55 13.41,32.53 14.17,31.77 14.17,28.84 14.98,28.03 14.98,24.81 13.77,23.59 v13.77,23.34
N$9  (via drill 0.35)
  Top 0.457: v11.99,17.9 10.84,19.05 R11.2
  Bottom 0.457: J8.P$3 44.8,25.63 45.11,25.33 45.11,24.7 38.31,17.9 v11.99,17.9
N$10
  Top 0.457: J1.VCC 20.72,4.78 20.72,6.11 23.47,8.87 D2.+
  Top 0.762: 20.72,6.11 19.45,7.38 17.83,7.38 17.02,8.2 C8.2
POWER1  (via drill 0.35)
  Top 0.254: v27.69,3.52 29.47,3.52 S2.1
  Top 0.457: v8.64,16.22 8.51,16.35 R7.2
  Bottom 0.152: 16.05,11.5 16.05,11.87 15.15,12.78 14.37,12.78 13.21,13.94 11.58,13.94 10.74,14.78 10.09,14.78 v8.64,16.22
  Bottom 0.254: 16.05,11.5 16.05,5.5 18.03,3.52 v27.69,3.52
RST  (via drill 0.35)
  Top 0.152: v16.56,26.28 17.3,25.54 Q1.6
  Top 0.254: v20.62,51.94 18.39,51.94 SJR1.1
  Top 0.457: C2.2 22.9,31.84 22.94,31.84 23.17,32.06 23.17,32.1 23.94,32.87 R4.2 24.09,33.43 v23.22,34.31
  Top 0.61: S1.1 38.3,4.17 v38.3,4.95
  Bottom 0.457: v38.3,4.95 41,7.64 41,9.43 41.44,9.87 42.87,9.87 50.54,17.54 50.9,17.54 51.56,18.2 51.56,50.82 45.81,56.57 45.81,58.89 45.21,59.5 39.35,59.5 38.74,58.89 38.74,54.85 36.74,52.85 21.54,52.85 v20.62,51.94 20.62,36.9 v23.22,34.31 23.22,32.94 19.91,29.63 19.91,28.05 18.91,27.05 17.33,27.05 v16.56,26.28
RTS
  Top 0.152: Q1.5 17.91,26.16 18.59,26.16 19.2,25.55 19.58,25.55 Q1.1 23.37,25.54 24.32,24.59 U3.14
RXD  (via drill 0.35)
  Top 0.254: v32,50.01 34.52,50.01 SJR1.15 | v28.19,21.81 25.46,19.08 25.16,19.08 24.99,18.92 24.99,17.24 24.75,17 23.89,17 23.72,17.16 23.72,17.37 U3.2
  Bottom 0.152: 31.95,50.01 v32,50.01
  Bottom 0.254: 31.95,50.01 31.04,49.09 31.04,24.66 v28.19,21.81
SCL_5V  (via drill 0.35)
  Top 0.152: 2.03,26.1 J3.P$4 | v40.23,49.09 39.7,49.09 35.97,52.83 17.22,52.83 14.53,50.13 13.11,48.71 12.34,48.71
  Top 0.254: v43.03,27.63 43.87,28.47 43.87,30.92 45.73,32.78 45.73,38.03 44.8,38.96 J4.P$3 | 2.03,26.1 4.75,26.1 6.29,27.65 6.29,40.14 4.83,41.6 4.83,45.74 7.8,48.71 12.34,48.71 | U4.13 39.78,21.95 39.9,22.08 v39.9,25.62
  Top 0.762: J2.P$3 J4.P$3
  Bottom 0.152: v40.23,49.09 42.6,49.09 44.42,50.92 44.73,50.92 J2.P$3
  Bottom 0.254: v39.9,25.62 41.91,27.63 v43.03,27.63
SDA_5V  (via drill 0.35)
  Top 0.152: v44.35,25.01 48.23,28.9 48.23,43 47.47,43.76 J4.P$4 | v6.3,24.15 7.42,25.27 v9.6,25.27
  Top 0.254: U4.12 37.34,21.3 v37.31,21.33
  Top 0.762: J4.P$4 J2.P$4
  Bottom 0.152: v44.35,25.01 40.66,21.33 v37.31,21.33
  Bottom 0.254: v37.31,21.33 36.83,20.85 14.76,20.85 10.35,25.27 v9.6,25.27 | J3.P$5 5.25,28.6 6.3,27.55 v6.3,24.15
TXD  (via drill 0.35)
  Top 0.254: v32,52.04 34.49,52.04 SJR1.16 | U3.3 24.32,19.16 v26.98,21.81
  Bottom 0.254: v32,52.04 32,50.94 30.63,49.56 30.63,25.4 27.04,21.81 v26.98,21.81

### Text on the board
tPlace: ArimScience | GND | 5V | A0 | GND | 5V | SCL | SDA | V1.4 | GND | 5V | SCL | SDA | GND | 12V | D5 | D6 | GND | 5V | D7 | GND | 3V3 | SCL | SDA | GND | 5V | D8 | GND | 5V | D3 | D4 | 3v3 | 5v | FLASH | RESET